# EAGLE design OptoBed (EAGLE 8.3.0)
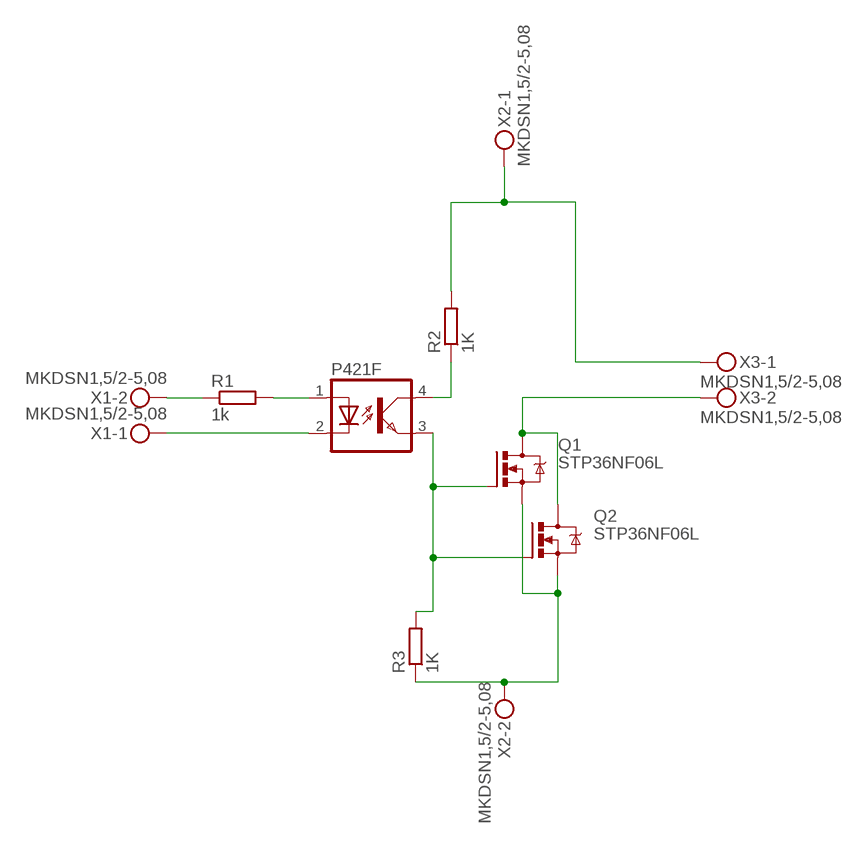
[diagram p0: schematic, sheet 1]

## Parts
P421F  OPTOTRANSPC817  [DIL04]
Q1  STP36NF06L  IRF740  [TO220BV]
Q2  STP36NF06L  IRF740  [TO220BV]
R1  1k  R_0805  [R0805]
R2  1K  R_0805  [R0805]
R3  1K  R_0805  [R0805]
X1  MKDSN1,5/2-5,08  [MKDSN1,5/2-5,08]
X2  MKDSN1,5/2-5,08  [MKDSN1,5/2-5,08]
X3  MKDSN1,5/2-5,08  [MKDSN1,5/2-5,08]

## Nets
N$1: R1.1 X1.2
N$2: P421F.1(A) R1.2
N$3: P421F.2(C) X1.1
N$4: P421F.3(EMIT) Q1.G Q2.G R3.2
N$5: Q1.S Q2.S R3.1 X2.2
N$6: Q1.D Q2.D X3.2
N$8: P421F.4(COL) R2.1
N$9: R2.2 X2.1 X3.1

## Library data of the parts
P421F = Namenlos:OPTOTRANS: SHARP OPTO COUPLER; MPN: PC817X4J000F; OC_FARNELL: 9707727; OC_NEWARK: 97K7059
Q1 Q2 = transistor-power:IRF740: N-CHANNEL MOS FET
R1-R3 = Namenlos:R_
X1-X3 = con-phoenix-508:MKDSN1,5/2-5,08: MKDSN 1,5/ 2-5,08 Printklemme Nennstrom: 13,5 A Nennspannung: 250 V Rastermaß: 5,08 mm Polzahl: 2 Anschlussart: Schraubanschluss Montage: Löten Anschlussrichtung Leiter/Platine: 0 ° Artikelnummer: 1729128 Source: http://eshop.phoenixcontact.com .. 1729128.pdf

## Board
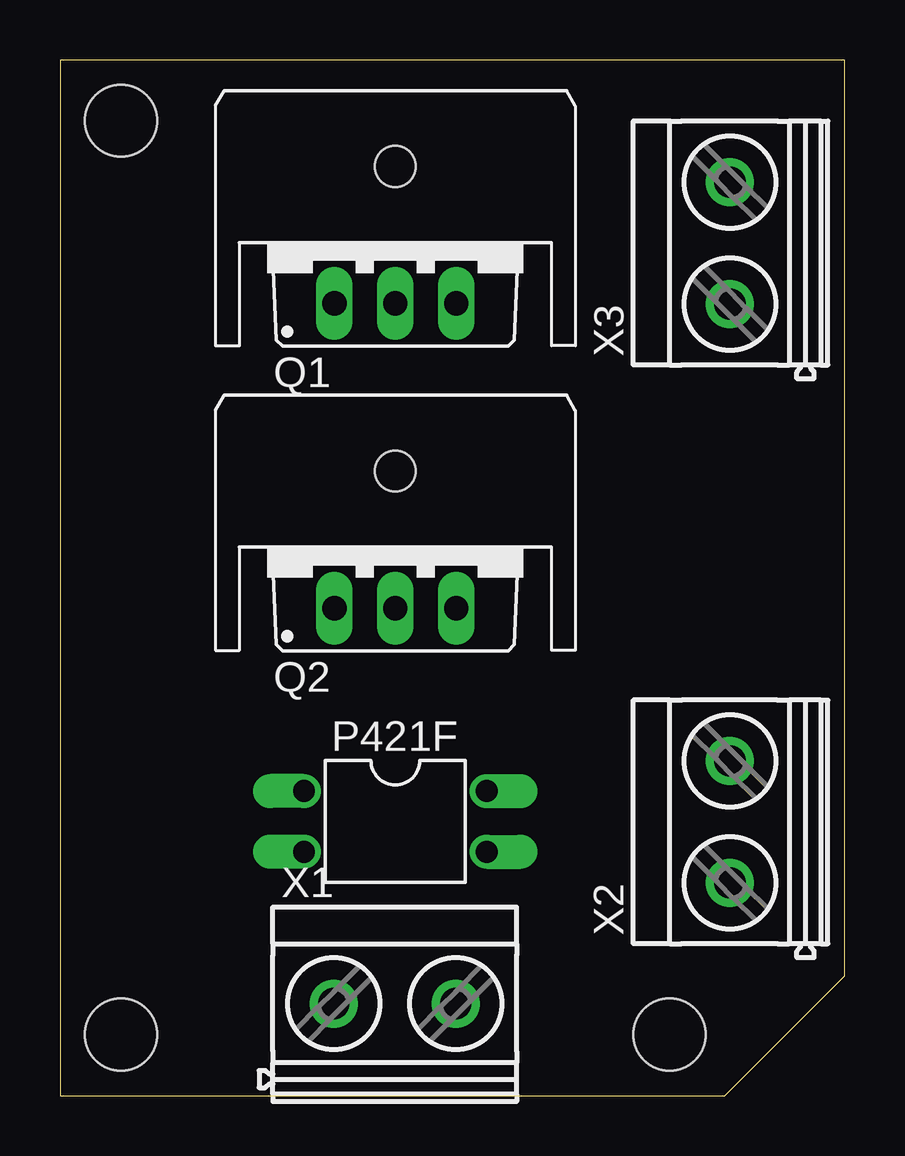
[diagram p1: board, top side]
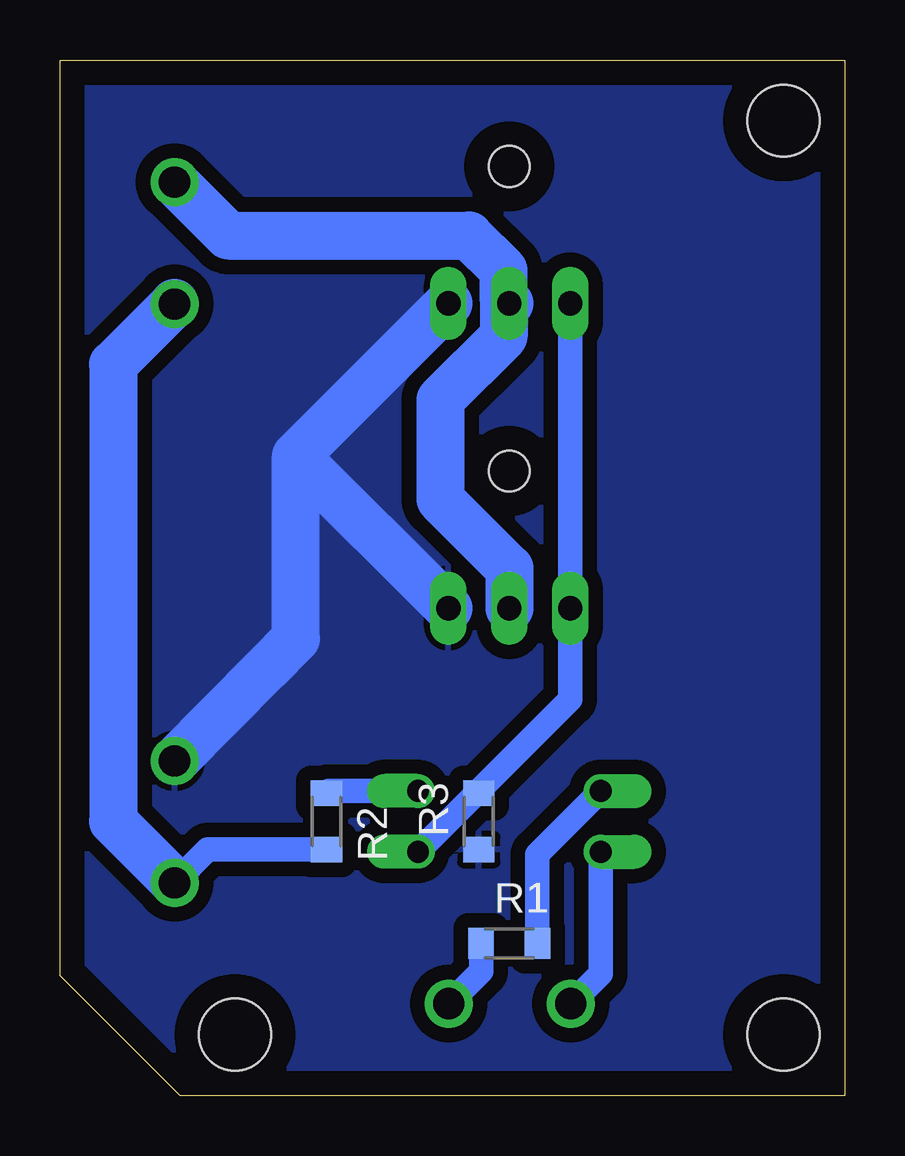
[diagram p2: board, bottom side, seen from below]

Size 32.69 x 43.17 mm. Coordinates in mm from the lower left corner, seen from the top.
Outline: 0,0 27.69,0 32.69,5 32.69,43.17 0,43.17 0,0
Copper layers (1*16): Top 0.035mm / dielectric 1.5mm / Bottom 0.035mm
Design rules "default *": minimum track width 6mil, minimum drill 0.35mm, track to track 12mil, track to pad 12mil, pad to pad 12mil, via to via 12mil, smd to smd 12mil, copper to edge 40mil, drill to drill 6mil, minimum pad ring 10mil, minimum via ring 8mil, stop-mask expansion 4mil, vias tented up to drill 0mil, thermal gap 10mil
Holes 3 mm at 2.54,40.64 2.54,2.54 25.4,2.54

### Footprints (pad centres in the part's own frame; a part is rotated, then mirrored left to right if it is on the bottom)
DIL04 = drill 0.9 pad 1.27 offset: 1 -1.27,-3.81; 2 1.27,-3.81; 3 1.27,3.81; 4 -1.27,3.81
TO220BV = drill 1.016 long: D 0,-2.54; G -2.54,-2.54; S 2.54,-2.54
R0805 = smd 1.05 x 1.3: 1 -1.175,0; 2 1.175,0
SK95-3M3_HOLE = hole 1.7: 0,3.175
MKDSN1,5/2-5,08 = drill 1.3 pad 2: 1 -2.561,0.025; 2 2.519,0.025

### Placement (x,y rotation side)
P421F  13.97,11.43 270 top
Q1  13.97,35.56 0 top
Q2  13.97,22.86 0 top
R1  13.97,6.35 0 bottom
R2  21.59,11.43 270 bottom
R3  15.24,11.43 90 bottom
U$1  [SK95-3M3_HOLE]  13.97,22.86 0 top
U$2  [SK95-3M3_HOLE]  13.97,35.56 0 top
X1  13.97,3.81 0 top
X2  27.94,11.43 90 top
X3  27.94,35.56 90 top

### Tracks (layer width: path | path; a pad name or v marks a point on that pad's centre or on a via)
N$1
  Bottom 1.016: R1.1 15.14,5.18 X1.2
N$2
  Bottom 1.016: R1.2 12.79,10.06 P421F.1
N$3
  Bottom 1.016: P421F.2 10.16,5.08 11.43,3.81 X1.1
N$4
  Bottom 1.016: Q2.G 11.43,19.14 | Q2.G 11.43,16.51 15.24,12.7 | 15.24,12.7 P421F.3 | Q1.G Q2.G | R3.2 15.24,12.7
N$5
  Bottom 2: 22.86,26.67 Q2.S | 22.86,26.67 Q1.S | X2.2 24.11,17.8 22.86,19.05 22.86,26.67
  pour Bottom (isolate 0.61): 0,0 0,43.18 33.02,43.18 33.02,5.08 27.94,0
N$6
  Bottom 2: Q2.D 13.97,21.98 16.84,24.85 16.84,29.01 14.21,31.64 14.21,33.26 | X3.2 25.69,35.85 15.65,35.85 14.21,34.4 14.21,33.26 | Q1.D 14.21,33.26
N$8
  Bottom 1.016: P421F.4 21.5,12.7 R2.1
N$9
  Bottom 1.016: 27.89,8.89 X2.1 26.53,10.26 R2.2
  Bottom 2: X3.1 27.92,33.05 30.48,30.48 30.48,11.43 X2.1